# EAGLE design power-12VAC-5DC-7805 (EAGLE 7.3.0)
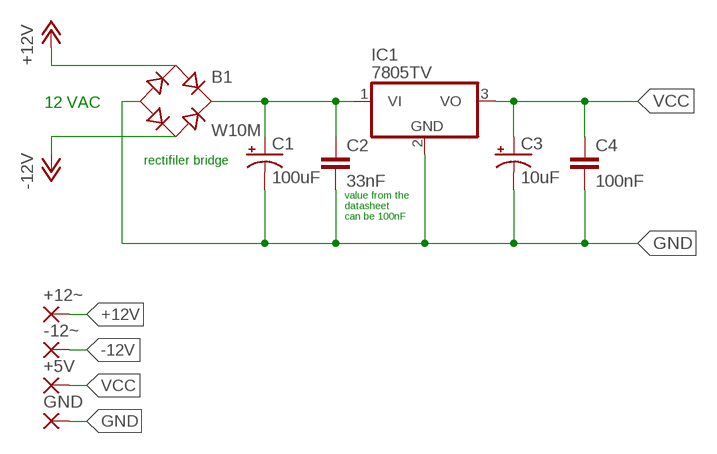
[diagram p0: schematic, sheet 1]

## Parts
+5V  WIREPAD2,15/1,0  [2,15/1,0]
+12~  WIREPAD2,15/1,0  [2,15/1,0]
-12~  WIREPAD2,15/1,0  [2,15/1,0]
B1  W10M  RB1A  [RB1A]
C1  100uF  CAP_POLPTH1  [CPOL-RADIAL-100UF-25V]
C2  33nF  CAPPTH  [CAP-PTH-SMALL]
C3  10uF  CAP_POLPTH1  [CPOL-RADIAL-100UF-25V]
C4  100nF  CAPPTH  [CAP-PTH-SMALL]
GND  WIREPAD2,15/1,0  [2,15/1,0]
IC1  7805TV  [TO220V]

## Nets
+12V: +12~.1(P) B1.AC1
-12V: -12~.1(P) B1.AC2
GND: B1.- C1.2(-) C2.2 C3.2(-) C4.2 GND.1(P) IC1.2(GND)
N$1: B1.+ C1.1(+) C2.1 IC1.1(VI)
VCC: +5V.1(P) C3.1(+) C4.1 IC1.3(VO)

## Notes on the sheet
- 12 VAC
- rectifiler bridge
- value from the
  datasheet
  can be 100nF

## Library data of the parts
+5V +12~ -12~ GND = wirepad:WIREPAD: Wire PAD connect wire on PCB
B1 = rectifier:RB1A: RECTIFIER 1 A
C1 C3 = SparkFun-Capacitors:CAP_POL: Capacitor Polarized These are standard SMD and PTH capacitors. Normally 10uF, 47uF, and 100uF in electrolytic and tantalum varieties. Always verify the external diameter of the through hole cap, it varies with capacity, voltage, and manufacturer. The EIA devices should be standard.
C2 C4 = SparkFun-Capacitors:CAP: Capacitor Standard 0603 ceramic capacitor, and 0.1" leaded capacitor.
IC1 = linear:78*: Positive VOLTAGE REGULATOR Source: http://cache.national.com/ds/LM/LM78L05.pdf http://www.fairchildsemi.com/ds/LM/LM7805.pdf

## Board
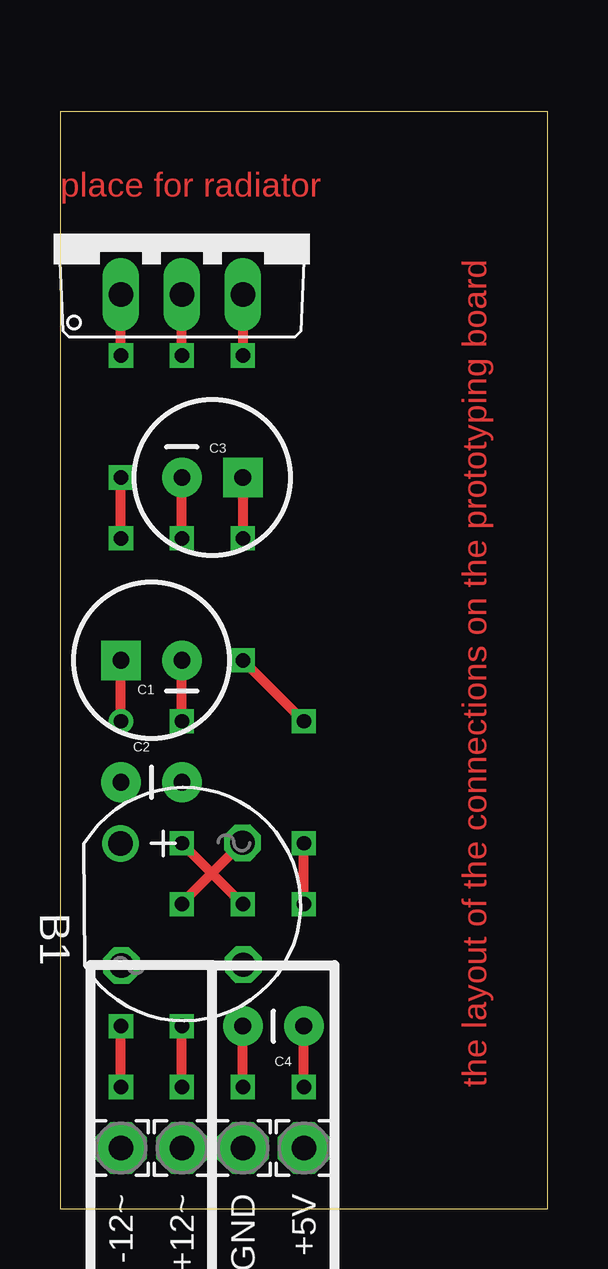
[diagram p1: board, top side]
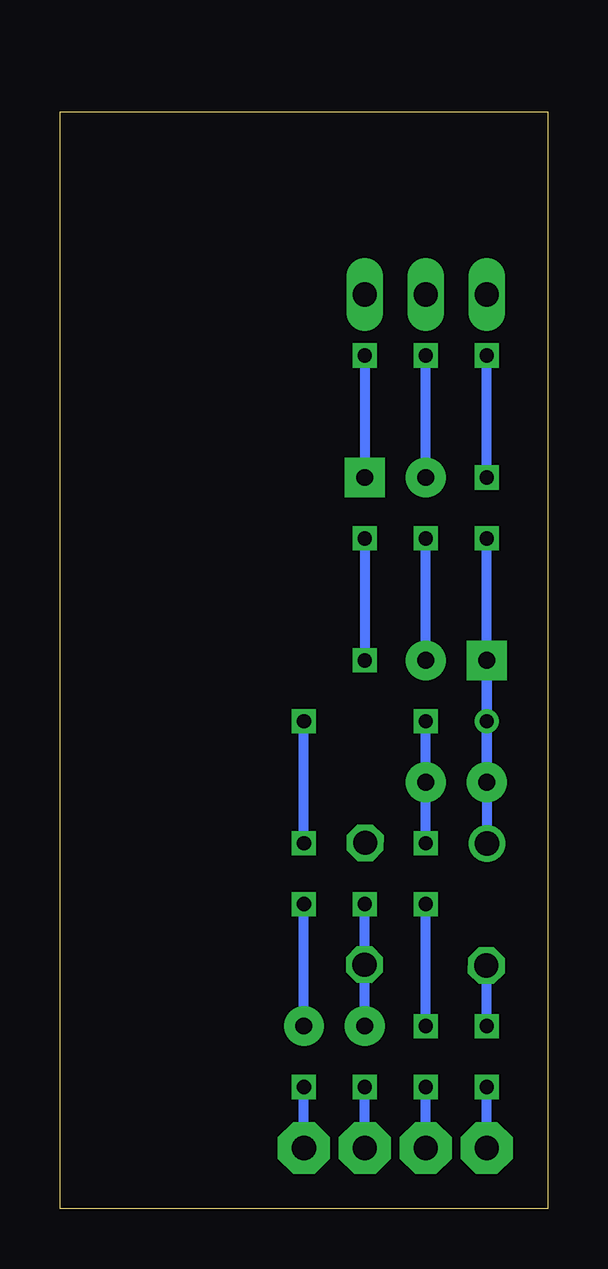
[diagram p2: board, bottom side, seen from below]

Size 20.32 x 45.72 mm. Coordinates in mm from the lower left corner, seen from the top.
Outline: 0,0 20.32,0 20.32,45.72 0,45.72 0,0
Copper layers (1*16): Top 0.035mm / dielectric 1.5mm / Bottom 0.035mm
Design rules "default": minimum track width 10mil, minimum drill 24mil, track to track 8mil, track to pad 8mil, pad to pad 8mil, via to via 8mil, smd to smd 8mil, copper to edge 40mil, drill to drill 8mil, minimum pad ring 10mil, minimum via ring 8mil, stop-mask expansion 4mil, vias tented up to drill 0mil, thermal gap 10mil

### Footprints (pad centres in the part's own frame; a part is rotated, then mirrored left to right if it is on the bottom)
2,15/1,0 = drill 1.016 pad 2.159 octagon: 1 0,0
RB1A = drill 1.016: + -2.54,2.54 | drill 1.016 octagon: - 2.54,-2.54; AC1 2.54,2.54; AC2 -2.54,-2.54
CPOL-RADIAL-100UF-25V = drill 0.7 pad 1.651 square: 1 1.27,0 | drill 0.7 pad 1.651: 2 -1.27,0
CAP-PTH-SMALL = drill 0.7 pad 1.651: 1 0,0; 2 2.54,0
TO220V = drill 1.016 long: 1 -2.54,-2.54; 2 0,-2.54; 3 2.54,-2.54

### Placement (x,y rotation side)
+5V  10.16,2.54 0 top
+12~  5.08,2.54 0 top
-12~  2.54,2.54 0 top
B1  5.08,12.7 0.4 top
C1  3.81,22.86 180 top
C2  2.54,17.78 0 top
C3  6.35,30.48 0 top
C4  10.16,7.62 180 top
GND  7.62,2.54 0 top
IC1  5.08,40.64 0 top

### Tracks (layer width: path | path; a pad name or v marks a point on that pad's centre or on a via)
+12V  (via drill 0.6)
  Top 0.406: v5.08,5.08 v5.08,7.62 | v5.08,12.7 5.08,12.73 B1.AC1
  Bottom 0.406: +12~.1 v5.08,5.08 | v5.08,7.62 v5.08,12.7
-12V  (via drill 0.6)
  Top 0.406: v2.54,5.08 v2.54,7.62
  Bottom 0.406: -12~.1 v2.54,5.08 | v2.54,7.62 2.54,10.12 B1.AC2
GND  (via drill 0.6)
  Top 0.406: v7.62,5.08 C4.2 | v5.08,20.32 C1.2 | v5.08,27.94 C3.2 | v5.08,35.56 IC1.2 | v7.62,12.7 v5.08,15.24
  Bottom 0.406: GND.1 v7.62,5.08 | C4.2 7.62,10.16 B1.- 7.62,10.18 v7.62,12.7 | C1.2 v5.08,27.94 | C3.2 v5.08,35.56 | v5.08,15.24 C2.2 v5.08,20.32
  other vias: 5.08,30.48 7.62,7.62
N$1  (via drill 0.6)
  Top 0.406: v2.54,20.32 C1.1 | v2.54,35.56 IC1.1 | v2.54,27.94 v2.54,30.48
  Bottom 0.406: C1.1 C2.1 v2.54,27.94 | B1.+ 2.52,20.3 v2.54,20.32 | v2.54,30.48 v2.54,35.56
  other vias: 2.54,22.86 2.54,17.78
VCC  (via drill 0.6)
  Top 0.406: IC1.3 v7.62,35.56 | C3.1 v7.62,27.94 | v10.16,5.08 C4.1 | v10.16,12.7 v10.16,15.24 | v10.16,20.32 v7.62,22.86
  Bottom 0.406: v7.62,35.56 C3.1 | v7.62,27.94 v7.62,22.86 | +5V.1 v10.16,5.08 | C4.1 v10.16,12.7 | v10.16,15.24 v10.16,20.32

### Text on the board
Top: place for radiator | the layout of the connections on the prototyping board | red wires - additional cables / blue wires - protoboard connections
tNames: IN | OUT